# EAGLE schematic ADC_12_channel (EAGLE 7.2.0)
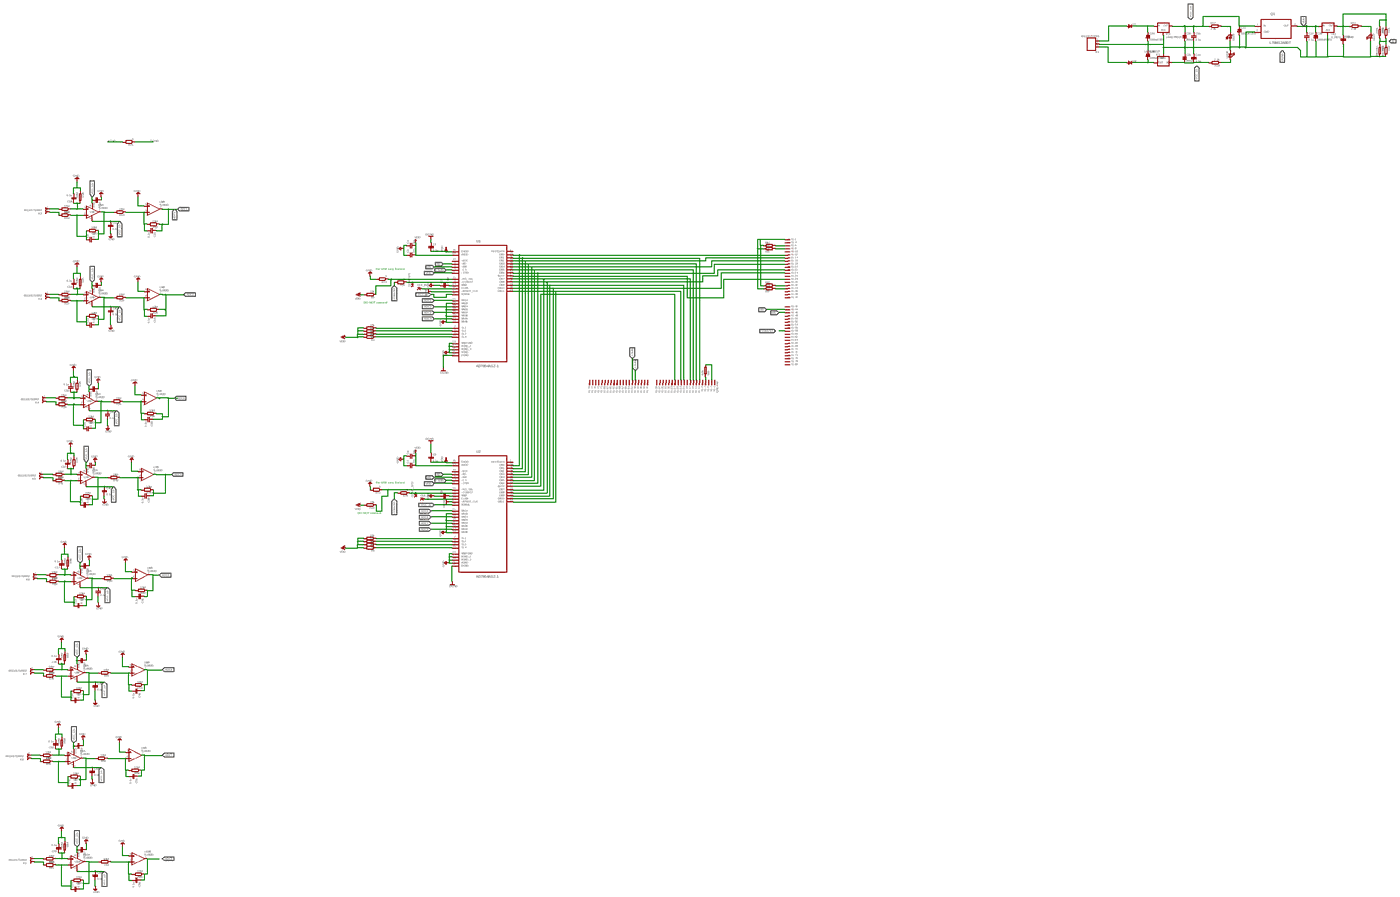
[diagram p0: schematic, sheet 1, overview]
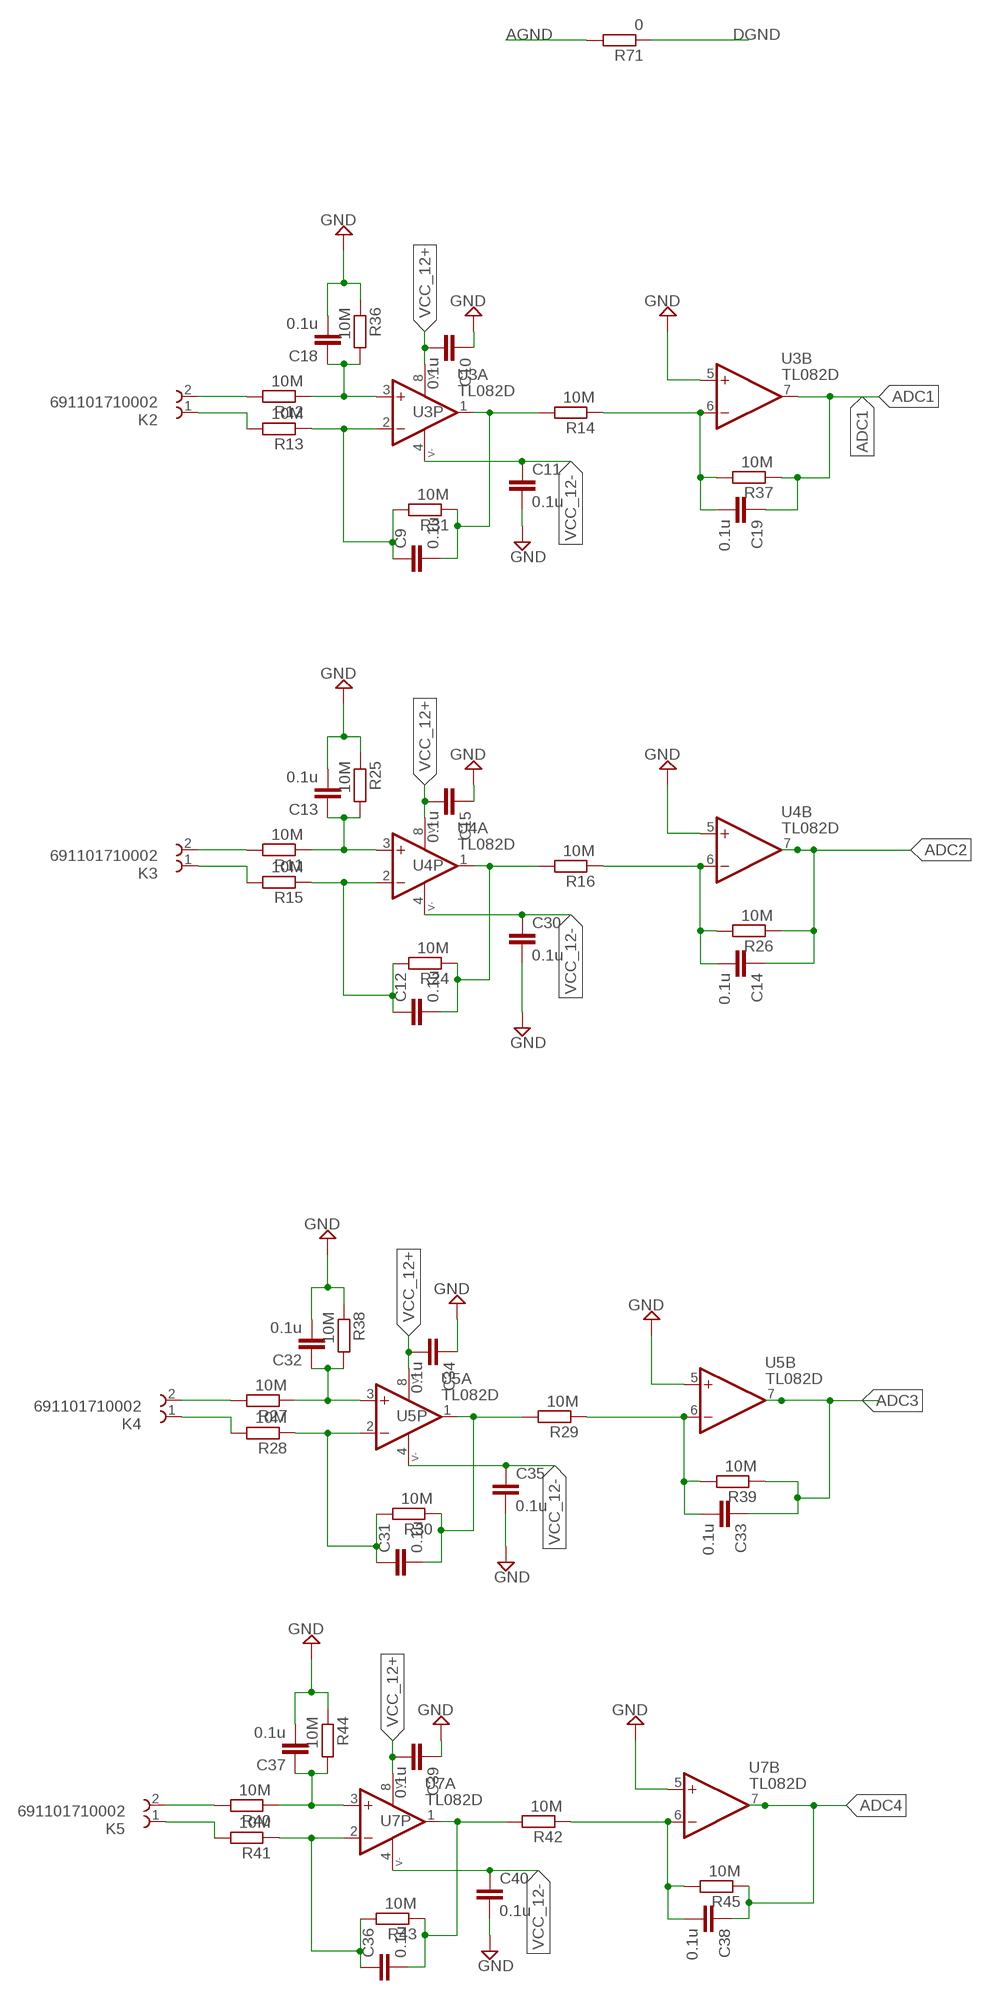
[diagram p1: schematic, sheet 1, part 1 of 4]
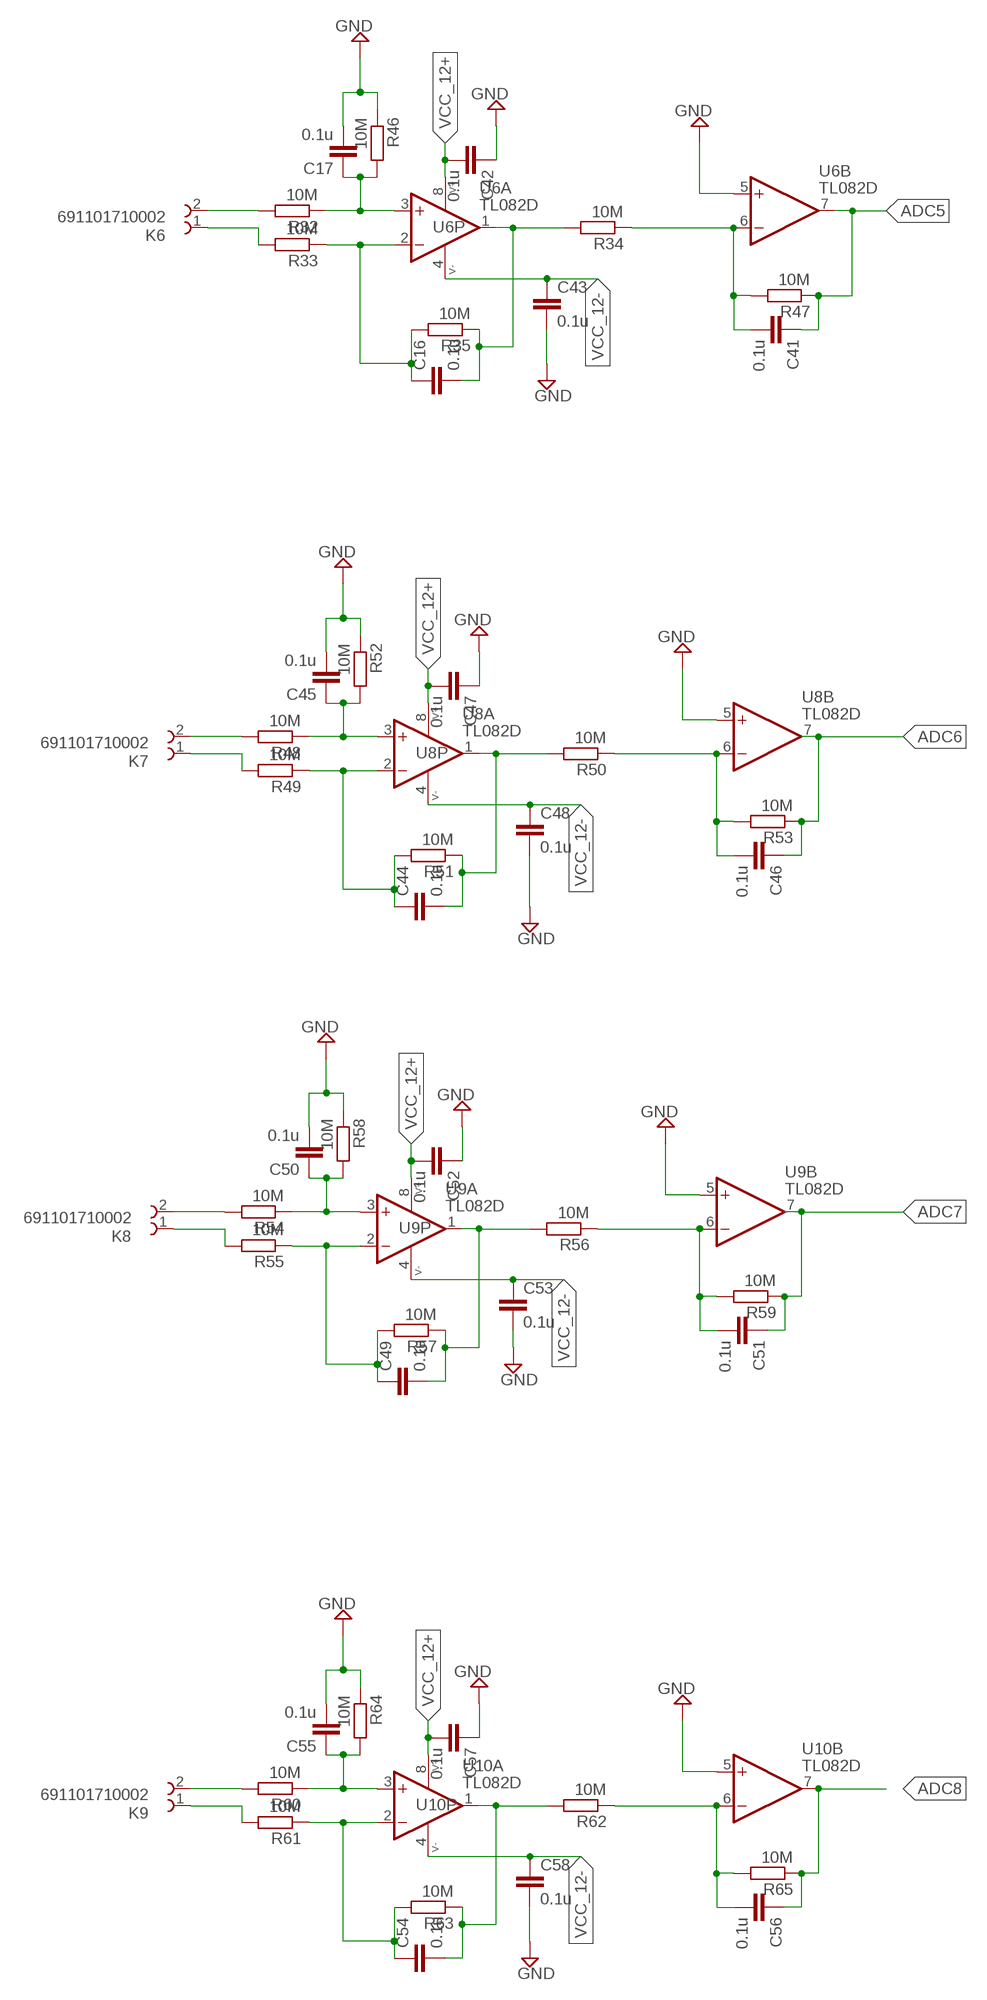
[diagram p2: schematic, sheet 1, part 2 of 4]
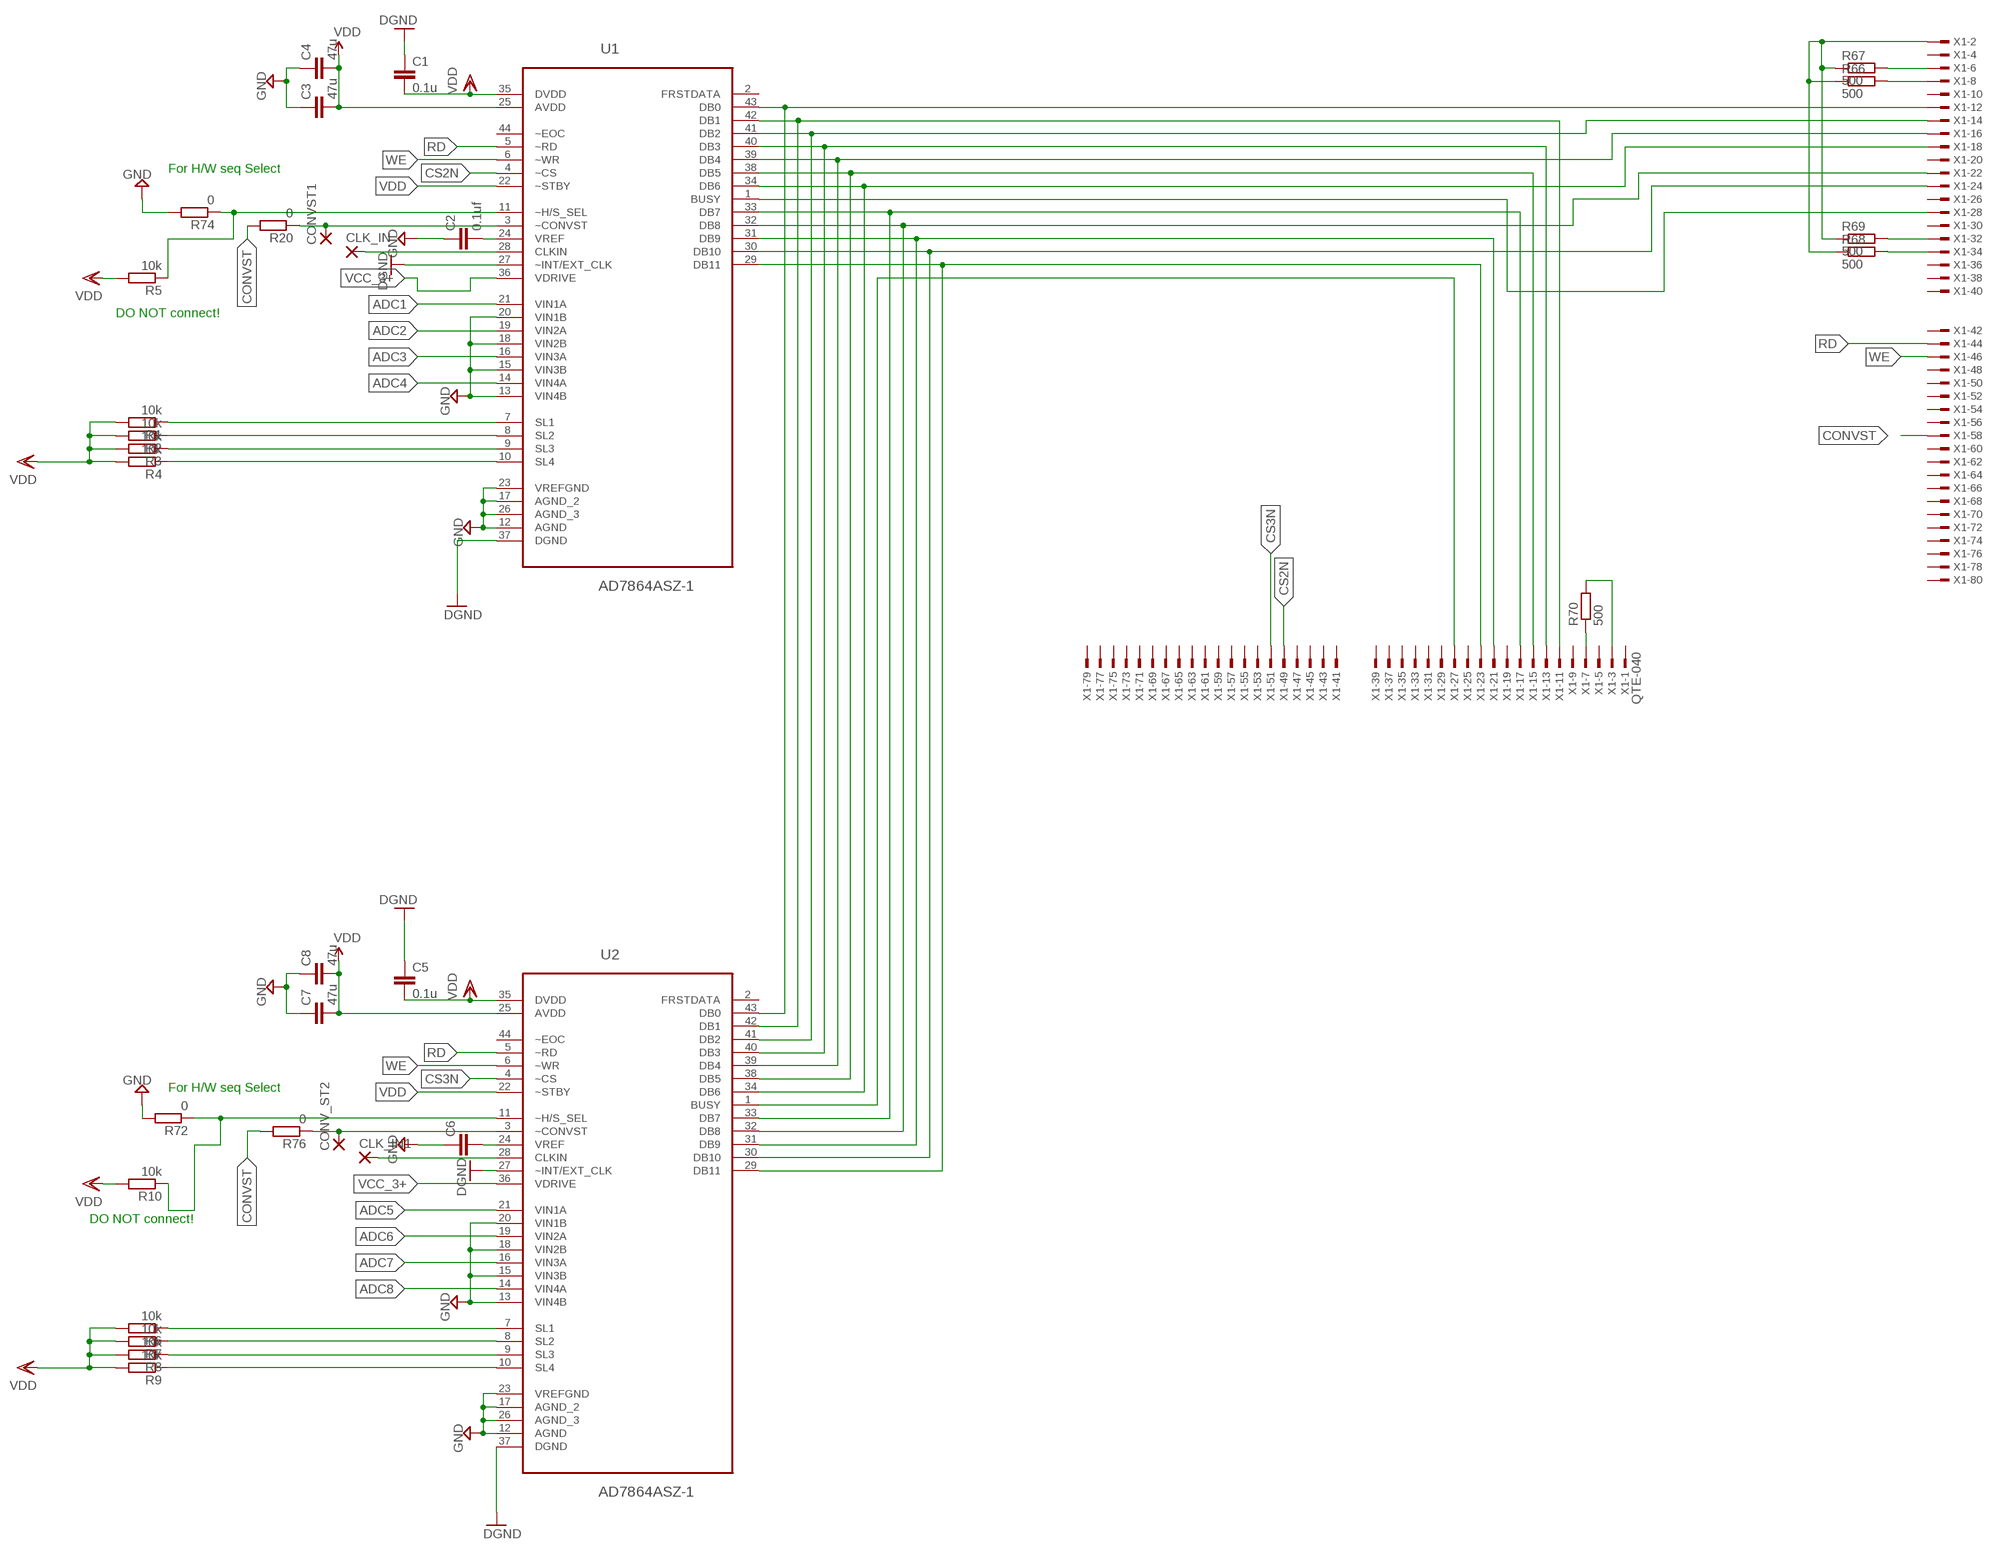
[diagram p3: schematic, sheet 1, part 3 of 4]
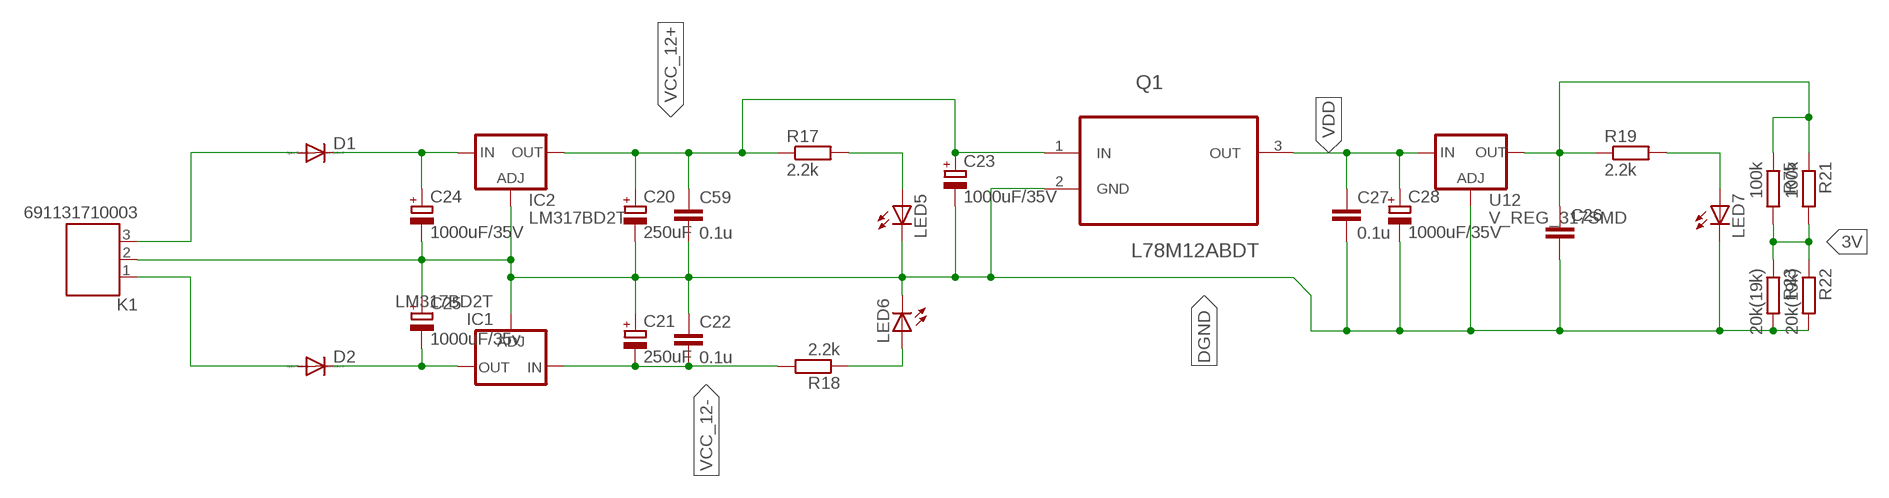
[diagram p4: schematic, sheet 1, part 4 of 4]

## Parts
C1  0.1u  C-EUC0603K  [C0603K]
C2  0.1uf  C-EUC0603K  [C0603K]
C3  47u  C-EUC1206K  [C1206K]
C4  47u  C-EUC1206K  [C1206K]
C5  0.1u  C-EUC0603K  [C0603K]
C6  C-EUC0603K  [C0603K]
C7  47u  C-EUC1206K  [C1206K]
C8  47u  C-EUC1206K  [C1206K]
C9  0.1u  C-EUC0603K  [C0603K]
C10  0.1u  C-EUC0603K  [C0603K]
C11  0.1u  C-EUC0603K  [C0603K]
C12  0.1u  C-EUC0603K  [C0603K]
C13  0.1u  C-EUC0603K  [C0603K]
C14  0.1u  C-EUC0603K  [C0603K]
C15  0.1u  C-EUC0603K  [C0603K]
C16  0.1u  C-EUC0603K  [C0603K]
C17  0.1u  C-EUC0603K  [C0603K]
C18  0.1u  C-EUC0603K  [C0603K]
C19  0.1u  C-EUC0603K  [C0603K]
C20  250uF  CPOL-EUE5-10.5  [E5-10,5]
C21  250uF  CPOL-EUE5-10.5  [E5-10,5]
C22  0.1u  C-EUC0603K  [C0603K]
C23  1000uF/35V  CPOL-EUE5-10.5  [E5-10,5]
C24  1000uF/35V  CPOL-EUE5-10.5  [E5-10,5]
C25  1000uF/35v  CPOL-EUE5-10.5  [E5-10,5]
C26  C-EUC1206K  [C1206K]
C27  0.1u  C-EUC0603K  [C0603K]
C28  1000uF/35V  CPOL-EUE5-10.5  [E5-10,5]
C30  0.1u  C-EUC0603K  [C0603K]
C31  0.1u  C-EUC0603K  [C0603K]
C32  0.1u  C-EUC0603K  [C0603K]
C33  0.1u  C-EUC0603K  [C0603K]
C34  0.1u  C-EUC0603K  [C0603K]
C35  0.1u  C-EUC0603K  [C0603K]
C36  0.1u  C-EUC0603K  [C0603K]
C37  0.1u  C-EUC0603K  [C0603K]
C38  0.1u  C-EUC0603K  [C0603K]
C39  0.1u  C-EUC0603K  [C0603K]
C40  0.1u  C-EUC0603K  [C0603K]
C41  0.1u  C-EUC0603K  [C0603K]
C42  0.1u  C-EUC0603K  [C0603K]
C43  0.1u  C-EUC0603K  [C0603K]
C44  0.1u  C-EUC0603K  [C0603K]
C45  0.1u  C-EUC0603K  [C0603K]
C46  0.1u  C-EUC0603K  [C0603K]
C47  0.1u  C-EUC0603K  [C0603K]
C48  0.1u  C-EUC0603K  [C0603K]
C49  0.1u  C-EUC0603K  [C0603K]
C50  0.1u  C-EUC0603K  [C0603K]
C51  0.1u  C-EUC0603K  [C0603K]
C52  0.1u  C-EUC0603K  [C0603K]
C53  0.1u  C-EUC0603K  [C0603K]
C54  0.1u  C-EUC0603K  [C0603K]
C55  0.1u  C-EUC0603K  [C0603K]
C56  0.1u  C-EUC0603K  [C0603K]
C57  0.1u  C-EUC0603K  [C0603K]
C58  0.1u  C-EUC0603K  [C0603K]
C59  0.1u  C-EUC0603K  [C0603K]
CLK_IN  3,17/1,3  [3,17/1,3]
CLK_IN1  3,17/1,3  [3,17/1,3]
CONV_ST2  3,17/1,3  [3,17/1,3]
CONVST1  3,17/1,3  [3,17/1,3]
D1  DIODE-DO-214AC  [DO-214AC]
D2  DIODE-DO-214AC  [DO-214AC]
IC1  LM317BD2T  [D2PACK]
IC2  LM317BD2T  [D2PACK]
K1  691131710003  [691131710003]
K2  691101710002  [691101710002]
K3  691101710002  [691101710002]
K4  691101710002  [691101710002]
K5  691101710002  [691101710002]
K6  691101710002  [691101710002]
K7  691101710002  [691101710002]
K8  691101710002  [691101710002]
K9  691101710002  [691101710002]
LED5  LEDSML1206  [SML1206]
LED6  LEDSMT1206  [1206]
LED7  LEDSMT1206  [1206]
Q1  L78M12ABDT  [TO225P972X240-3N]
R1  10k  R-EU_M1206  [M1206]
R2  10k  R-EU_M1206  [M1206]
R3  10k  R-EU_M1206  [M1206]
R4  10k  R-EU_M1206  [M1206]
R5  10k  R-EU_M1206  [M1206]
R6  10k  R-EU_M1206  [M1206]
R7  10k  R-EU_M1206  [M1206]
R8  10k  R-EU_M1206  [M1206]
R9  10k  R-EU_M1206  [M1206]
R10  10k  R-EU_M1206  [M1206]
R11  10M  R-EU_M1206  [M1206]
R12  10M  R-EU_M1206  [M1206]
R13  10M  R-EU_M1206  [M1206]
R14  10M  R-EU_M1206  [M1206]
R15  10M  R-EU_M1206  [M1206]
R16  10M  R-EU_M1206  [M1206]
R17  2.2k  R-EU_R1206  [R1206]
R18  2.2k  R-EU_R1206  [R1206]
R19  2.2k  R-EU_R1206  [R1206]
R20  0  R-EU_M1206  [M1206]
R21  100k  R-EU_R1206  [R1206]
R22  20k(19k)  R-EU_R1206  [R1206]
R23  20k(19k)  R-EU_R1206  [R1206]
R24  10M  R-EU_M1206  [M1206]
R25  10M  R-EU_M1206  [M1206]
R26  10M  R-EU_M1206  [M1206]
R27  10M  R-EU_M1206  [M1206]
R28  10M  R-EU_M1206  [M1206]
R29  10M  R-EU_M1206  [M1206]
R30  10M  R-EU_M1206  [M1206]
R31  10M  R-EU_M1206  [M1206]
R32  10M  R-EU_M1206  [M1206]
R33  10M  R-EU_M1206  [M1206]
R34  10M  R-EU_M1206  [M1206]
R35  10M  R-EU_M1206  [M1206]
R36  10M  R-EU_M1206  [M1206]
R37  10M  R-EU_M1206  [M1206]
R38  10M  R-EU_M1206  [M1206]
R39  10M  R-EU_M1206  [M1206]
R40  10M  R-EU_M1206  [M1206]
R41  10M  R-EU_M1206  [M1206]
R42  10M  R-EU_M1206  [M1206]
R43  10M  R-EU_M1206  [M1206]
R44  10M  R-EU_M1206  [M1206]
R45  10M  R-EU_M1206  [M1206]
R46  10M  R-EU_M0805  [M0805]
R47  10M  R-EU_M1206  [M1206]
R48  10M  R-EU_M1206  [M1206]
R49  10M  R-EU_M1206  [M1206]
R50  10M  R-EU_M1206  [M1206]
R51  10M  R-EU_M1206  [M1206]
R52  10M  R-EU_M0805  [M0805]
R53  10M  R-EU_M1206  [M1206]
R54  10M  R-EU_M1206  [M1206]
R55  10M  R-EU_M1206  [M1206]
R56  10M  R-EU_M1206  [M1206]
R57  10M  R-EU_M1206  [M1206]
R58  10M  R-EU_M0805  [M0805]
R59  10M  R-EU_M1206  [M1206]
R60  10M  R-EU_M1206  [M1206]
R61  10M  R-EU_M1206  [M1206]
R62  10M  R-EU_M1206  [M1206]
R63  10M  R-EU_M1206  [M1206]
R64  10M  R-EU_M1206  [M1206]
R65  10M  R-EU_M1206  [M1206]
R66  500  R-EU_M1206  [M1206]
R67  500  R-EU_M1206  [M1206]
R68  500  R-EU_M1206  [M1206]
R69  500  R-EU_M1206  [M1206]
R70  500  R-EU_M1206  [M1206]
R71  0  R-EU_M1206  [M1206]
R72  0  R-EU_M1206  [M1206]
R74  0  R-EU_M1206  [M1206]
R75  100k  R-EU_R1206  [R1206]
R76  0  R-EU_M1206  [M1206]
U1  AD7864ASZ-1  [QFP80P1390X1390X245-44N]
U2  AD7864ASZ-1  [QFP80P1390X1390X245-44N]
U3  TL082D  [SO08]
U4  TL082D  [SO08]
U5  TL082D  [SO08]
U6  TL082D  [SO08]
U7  TL082D  [SO08]
U8  TL082D  [SO08]
U9  TL082D  [SO08]
U10  TL082D  [SO08]
U12  V_REG_317SMD  [SOT223]
X1  QTE-040  [QTE-040]

## Nets
3V: R21.2 R22.1 R23.1 R75.2
ADC1: C19.1 R37.1 U1.21(VIN1A) U3.7(B:OUT)
ADC2: C14.1 R26.1 U1.19(VIN2A) U4.7(B:OUT)
ADC3: C33.1 R39.1 U1.16(VIN3A) U5.7(B:OUT)
ADC4: C38.1 R45.1 U1.14(VIN4A) U7.7(B:OUT)
ADC5: C41.1 R47.1 U2.21(VIN1A) U6.7(B:OUT)
ADC6: C46.1 R53.1 U2.19(VIN2A) U8.7(B:OUT)
ADC7: C51.1 R59.1 U2.16(VIN3A) U9.7(B:OUT)
ADC8: C56.1 R65.1 U2.14(VIN4A) U10.7(B:OUT)
AGND: C2.1 C3.1 C4.1 C6.1 C7.1 C8.1 C13.2 C17.2 C18.2 C32.2 C37.2 C45.2 C50.2 C55.2 R25.1 R36.1 R38.1 R44.1 R46.1 R52.1 R58.1 R64.1 R71.2 U1.12(AGND) U1.13(VIN4B) U1.15(VIN3B) U1.17(AGND_2) U1.18(VIN2B) U1.20(VIN1B) U1.23(VREFGND) U1.26(AGND_3) U2.12(AGND) U2.13(VIN4B) U2.15(VIN3B) U2.17(AGND_2) U2.18(VIN2B) U2.20(VIN1B) U2.23(VREFGND) U2.26(AGND_3) U3.5(B:+IN) U4.5(B:+IN) U5.5(B:+IN) U6.5(B:+IN) U7.5(B:+IN) U8.5(B:+IN) U9.5(B:+IN) U10.5(B:+IN) ; supply symbol labelled GND
CONVST: R20.2 R76.2 X1.58
CS2N: U1.4(~CS) X1.49
CS3N: U2.4(~CS) X1.51
DGND: C1.1 C5.1 C10.1 C11.2 C15.1 C20.- C21.+ C22.1 C23.- C24.- C25.+ C26.2 C27.2 C28.- C30.2 C34.1 C35.2 C39.1 C40.2 C42.1 C43.2 C47.1 C48.2 C52.1 C53.2 C57.1 C58.2 C59.2 IC1.1(ADJ) IC2.1(ADJ) K1.2 LED5.C LED6.C LED7.C Q1.2(GND) R22.2 R23.2 R71.1 R72.2 R74.2 U1.27(~INT/EXT_CLK) U1.37(DGND) U2.27(~INT/EXT_CLK) U2.37(DGND) U12.1(ADJ) ; supply symbol labelled GND
N$1: U1.43(DB0) U2.43(DB0) X1.12
N$2: C9.1 R13.1 R31.2 U3.2(A:-IN)
N$3: U1.41(DB2) U2.41(DB2) X1.14
N$4: U1.39(DB4) U2.39(DB4) X1.16
N$5: U1.34(DB6) U2.34(DB6) X1.18
N$6: U1.32(DB8) U2.32(DB8) X1.22
N$7: U1.30(DB10) U2.30(DB10) X1.24
N$8: U1.40(DB3) U2.40(DB3) X1.13
N$9: U1.38(DB5) U2.38(DB5) X1.15
N$10: U1.33(DB7) U2.33(DB7) X1.17
N$11: CLK_IN.1(P) U1.28(CLKIN)
N$12: U1.29(DB11) U2.29(DB11) X1.23
N$13: R4.1 U1.10(SL4)
N$14: R3.1 U1.9(SL3)
N$15: R2.1 U1.8(SL2)
N$16: C2.2 U1.24(VREF)
N$17: R1.1 U1.7(SL1)
N$18: CONVST1.1(P) R20.1 U1.3(~CONVST)
N$19: R5.1 R74.1 U1.11(~H/S_SEL)
N$20: R9.1 U2.10(SL4)
N$21: R8.1 U2.9(SL3)
N$22: R7.1 U2.8(SL2)
N$23: R6.1 U2.7(SL1)
N$24: C6.2 U2.24(VREF)
N$25: CONV_ST2.1(P) R76.1 U2.3(~CONVST)
N$26: R10.1 R72.1 U2.11(~H/S_SEL)
N$27: U1.42(DB1) U2.42(DB1) X1.11
N$28: K3.2 R11.2
N$29: C19.2 R14.1 R37.2 U3.6(B:-IN)
N$30: U1.31(DB9) U2.31(DB9) X1.21
N$31: K3.1 R15.2
N$32: K2.1 R13.2
N$33: C12.1 R15.1 R24.2 U4.2(A:-IN)
N$34: C12.2 R16.2 R24.1 U4.1(A:OUT)
N$35: C25.- D2.C IC1.3(OUT)
N$36: C24.+ D1.C IC2.2(IN)
N$37: LED5.A R17.2
N$38: LED6.A R18.1
N$39: D1.A K1.3
N$40: D2.A K1.1
N$41: LED7.A R19.2
N$43: K6.2 R32.2
N$44: K6.1 R33.2
N$45: C13.1 R11.1 R25.2 U4.3(A:+IN)
N$46: C14.2 R16.1 R26.2 U4.6(B:-IN)
N$48: CLK_IN1.1(P) U2.28(CLKIN)
N$50: U1.1(BUSY) X1.28
N$52: U2.1(BUSY) X1.27
N$53: K4.2 R27.2
N$54: K2.2 R12.2
N$55: C18.1 R12.1 R36.2 U3.3(A:+IN)
N$56: C9.2 R14.2 R31.1 U3.1(A:OUT)
N$57: K4.1 R28.2
N$58: C31.1 R28.1 R30.2 U5.2(A:-IN)
N$59: C31.2 R29.2 R30.1 U5.1(A:OUT)
N$60: C32.1 R27.1 R38.2 U5.3(A:+IN)
N$61: C16.1 R33.1 R35.2 U6.2(A:-IN)
N$62: C16.2 R34.2 R35.1 U6.1(A:OUT)
N$63: C17.1 R32.1 R46.2 U6.3(A:+IN)
N$64: C41.2 R34.1 R47.2 U6.6(B:-IN)
N$65: C33.2 R29.1 R39.2 U5.6(B:-IN)
N$66: K5.2 R40.2
N$67: K5.1 R41.2
N$68: C36.1 R41.1 R43.2 U7.2(A:-IN)
N$69: C36.2 R42.2 R43.1 U7.1(A:OUT)
N$70: C37.1 R40.1 R44.2 U7.3(A:+IN)
N$71: C38.2 R42.1 R45.2 U7.6(B:-IN)
N$72: K7.2 R48.2
N$73: K7.1 R49.2
N$74: C44.1 R49.1 R51.2 U8.2(A:-IN)
N$75: C44.2 R50.2 R51.1 U8.1(A:OUT)
N$76: C45.1 R48.1 R52.2 U8.3(A:+IN)
N$77: C46.2 R50.1 R53.2 U8.6(B:-IN)
N$78: K8.2 R54.2
N$79: K8.1 R55.2
N$80: C49.1 R55.1 R57.2 U9.2(A:-IN)
N$81: C49.2 R56.2 R57.1 U9.1(A:OUT)
N$82: C50.1 R54.1 R58.2 U9.3(A:+IN)
N$83: C51.2 R56.1 R59.2 U9.6(B:-IN)
N$84: K9.2 R60.2
N$85: K9.1 R61.2
N$86: C54.1 R61.1 R63.2 U10.2(A:-IN)
N$87: C54.2 R62.2 R63.1 U10.1(A:OUT)
N$88: C55.1 R60.1 R64.2 U10.3(A:+IN)
N$89: C56.2 R62.1 R65.2 U10.6(B:-IN)
N$90: R66.1 R67.1 R68.1 R69.1 X1.2
N$91: R67.2 X1.6
N$92: R66.2 X1.8
N$93: R69.2 X1.32
N$94: R68.2 X1.34
N$95: R70.2 X1.3
N$96: R70.1 X1.7
RD: U1.5(~RD) U2.5(~RD) X1.44
VCC_3+: U1.36(VDRIVE) U2.36(VDRIVE)
VCC_5+: C26.1 R19.1 R21.1 R75.1 U12.2(OUT)
VCC_12+: C10.2 C15.2 C20.+ C23.+ C34.2 C39.2 C42.2 C47.2 C52.2 C57.2 C59.1 IC2.3(OUT) Q1.1(IN) R17.1 U3.8(P:V+) U4.8(P:V+) U5.8(P:V+) U6.8(P:V+) U7.8(P:V+) U8.8(P:V+) U9.8(P:V+) U10.8(P:V+)
VCC_12-: C11.1 C21.- C22.2 C30.1 C35.1 C40.1 C43.1 C48.1 C53.1 C58.1 IC1.2(IN) R18.2 U3.4(P:V-) U4.4(P:V-) U5.4(P:V-) U6.4(P:V-) U7.4(P:V-) U8.4(P:V-) U9.4(P:V-) U10.4(P:V-)
VDD: C1.2 C3.2 C4.2 C5.2 C7.2 C8.2 C27.1 C28.+ Q1.3(OUT) R1.2 R2.2 R3.2 R4.2 R5.2 R6.2 R7.2 R8.2 R9.2 R10.2 U1.22(~STBY) U1.25(AVDD) U1.35(DVDD) U2.22(~STBY) U2.25(AVDD) U2.35(DVDD) U12.3(IN)
WE: U1.6(~WR) U2.6(~WR) X1.46
Unconnected: U1.2(FRSTDATA) U1.44(~EOC) U2.2(FRSTDATA) U2.44(~EOC) X1.1 X1.4 X1.5 X1.9 X1.10 X1.19 X1.20 X1.25 X1.26 X1.29 X1.30 X1.31 X1.33 X1.35 X1.36 X1.37 X1.38 X1.39 X1.40 X1.41 X1.42 X1.43 X1.45 X1.47 X1.48 X1.50 X1.52 X1.53 X1.54 X1.55 X1.56 X1.57 X1.59 X1.60 X1.61 X1.62 X1.63 X1.64 X1.65 X1.66 X1.67 X1.68 X1.69 X1.70 X1.71 X1.72 X1.73 X1.74 X1.75 X1.76 X1.77 X1.78 X1.79 X1.80

## Notes on the sheet
- For H/W seq Select
- DO NOT connect!
- For H/W seq Select
- DO NOT connect!

## Library data of the parts
C1-C19 C22 C26 C27 C30-C59 = rcl:C-EU: CAPACITOR, European symbol
C20 C21 C23-C25 C28 = rcl:CPOL-EU: POLARIZED CAPACITOR, European symbol
CLK_IN CLK_IN1 CONV_ST2 CONVST1 = wirepad:3,17/1,3: THROUGH-HOLE PAD
D1 D2 = diode:DIODE-: DIODE
IC1 = rathin_Vreg_D2pack:LM317?*: 500 mA Adjustable Output Positive Voltage Regulator Source: http://www.onsemi.co.jp .. LM317M-D.PDF
IC2 = v-reg:LM317?*: 500 mA Adjustable Output Positive Voltage Regulator Source: http://www.onsemi.co.jp .. LM317M-D.PDF
K1 = Wurth_Elektronik_Electromechanic_Terminal_Blocks_Connectors_rev15d:691131710003: WR-TBL Terminal block - CUU5/3 - 3 Pins;=>Code : Con_TBL_Screw_PClamp_5.00_6911317100xx_691131710003 <http://katalog.we-online.de/media/images/eican/Con_TBL_Screw_PClamp_5.00_6911317100xx_pf2.jpg> Details see: http://katalog.we-online.de/em/datasheet/6911317100xx.pdf Created 11/3/2014, Karrer Zheng 2014 (C) Wurth Elektronik
K2-K9 = Wurth_Elektronik_Electromechanic_Terminal_Blocks_Connectors_rev15d:691101710002: WR-TBL Serie 101 - 5.0mm HOrizontal Entry Modular with Pressure Clamp - 2.5mm2 Wires , 2 pins=>Code : Con-TBL_Screw_PressureClamp_691101710002 <http://katalog.we-online.de/media/images/eican/Con-TBL_Screw_PressureClamp_6911017100xx_pf2.jpg> Details see: http://katalog.we-online.de/en/em/691_101_710_0xx Created 2014-06-16, Karrer Zheng 2014 (C) Würth Elektronik
LED5-LED7 = led:LED: LED OSRAM: - CHIPLED LG R971, LG N971, LY N971, LG Q971, LY Q971, LO R971, LY R971 LH N974, LH R974 LS Q976, LO Q976, LY Q976 LO Q996 - Hyper CHIPLED LW Q18S LB Q993, LB Q99A, LB R99A - SideLED LS A670, LO A670, LY A670, LG A670, LP A670 LB A673, LV A673, LT A673, LW A673 LH A674 LY A675 LS A676, LA A676, LO A676, LY A676, LW A676 LS A679, LY A679, LG A679 - Hyper Micro SIDELED® LS Y876, LA Y876, LO Y876, LY Y876 LT Y87S - SmartLED LW L88C, LW L88S LB L89C, LB L89S, LG L890 LS L89K, LO L89K, LY L89K LS L896, LA L896, LO L896, LY L896 - TOPLED LS T670, LO T670, LY T670, LG T670, LP T670 LSG T670, LSP T670, LSY T670, LOP T670, LYG T670 LG T671, LOG T671, LSG T671 LB T673, LV T673, LT T673, LW T673 LH T674 LS T676, LA T676, LO T676, LY T676, LB T676, LH T676, LSB T676, LW T676 LB T67C, LV T67C, LT T67C, LS T67K, LO T67K, LY T67K, LW E67C LS E67B, LA E67B, LO E67B, LY E67B, LB E67C, LV E67C, LT E67C LW T67C LS T679, LY T679, LG T679 LS T770, LO T770, LY T770, LG T770, LP T770 LB T773, LV T773, LT T773, LW T773 LH T774 LS E675, LA E675, LY E675, LS T675 LS T776, LA T776, LO T776, LY T776, LB T776 LHGB T686 LT T68C, LB T68C - Hyper Mini TOPLED® LB M676 - Mini TOPLED Santana® LG M470 LS M47K, LO M47K, LY M47K Source: http://www.osram.convergy.de LUXEON: - LUMILED® LXK2-PW12-R00, LXK2-PW12-S00, LXK2-PW14-U00, LXK2-PW14-V00 LXK2-PM12-R00, LXK2-PM12-S00, LXK2-PM14-U00 LXK2-PE12-Q00, LXK2-PE12-R00, LXK2-PE12-S00, LXK2-PE14-T00, LXK2-PE14-U00 LXK2-PB12-K00, LXK2-PB12-L00, LXK2-PB12-M00, LXK2-PB14-N00, LXK2-PB14-P00, LXK2-PB14-Q00 LXK2-PR12-L00, LXK2-PR12-M00, LXK2-PR14-Q00, LXK2-PR14-R00 LXK2-PD12-Q00, LXK2-PD12-R00, LXK2-PD12-S00 LXK2-PH12-R00, LXK2-PH12-S00 LXK2-PL12-P00, LXK2-PL12-Q00, LXK2-PL12-R00 Source: www.luxeon.com KINGBRIGHT: KA-3528ASYC Source: www.kingbright.com
Q1 = ST Microelctronics_By_element14_Batch_1:L78M12ABDT: PRECISION 500mA REGULATORS; MPN: L78M12ABDT; OC_FARNELL: 1087128; OC_NEWARK: -; PACKAGE: DPAK; SUPPLIER: STMICROELECTRONICS
R1-R16 R20 R24-R72 R74 R76 = resistor:R-EU_: RESISTOR, European symbol
R17-R19 R21-R23 R75 = rcl:R-EU_: RESISTOR, European symbol
U1 U2 = AD7864AS:AD7864ASZ-1: 12-Bit ADC; MPN: AD7864ASZ-1; OC_FARNELL: 9603611; OC_NEWARK: 59K5750; PACKAGE: QFP-44; SUPPLIER: ANALOG DEVICES
U3-U10 = op-amp:TL082: JFET OP-AMP - Dual
U12 = SparkFun-PowerIC:V_REG_317: Voltage Regulator Standard LM317 adjustable voltage regulator. AOI (Adjust Output Input). Google 'LM317 Calculator' for easy to use app to get the two resistor values needed. 240/720 for 5V output. 240/390 for 3.3V output. Spark Fun Electronics SKU : COM-00527
X1 = con-samtec:QTE-040: 0,8mm HI-SPEED HEADER QTE Series Source: http://www.samtec.com/ftppub/pdf/QTE.PDF http://www.samtec.com/ftppub/cpdf/QTE-XXX-XX-X-D-XXX-FOOTPRINT.pdf; OC_FARNELL: unknown; OC_NEWARK: unknown